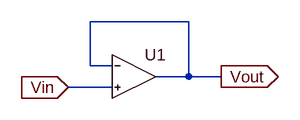
[diagram p0: schematic sourceFollowerOTA2.asc]
sourceFollowerOTA2.asc, the LTspice schematic file:
Version 4
SHEET 1 880 680
WIRE 304 48 160 48
WIRE 160 112 160 48
WIRE 192 112 160 112
WIRE 304 128 304 48
WIRE 304 128 256 128
WIRE 352 128 304 128
WIRE 192 144 128 144
FLAG 128 144 Vin
IOPIN 128 144 In
FLAG 352 128 Vout
IOPIN 352 128 Out
SYMBOL OTA2 224 128 R0
SYMATTR InstName U1

The netlist it stands for:
* sourceFollowerOTA2.asc
XU1 Vin Vout Vout OPAMP1  ; pins In+ In- OUT
.backanno
.end